# EasyEDA Pro project miniMagSwitch.eprj

# Schematic Schematic1
Board Name: Board1; Create Date: 2024-08-31
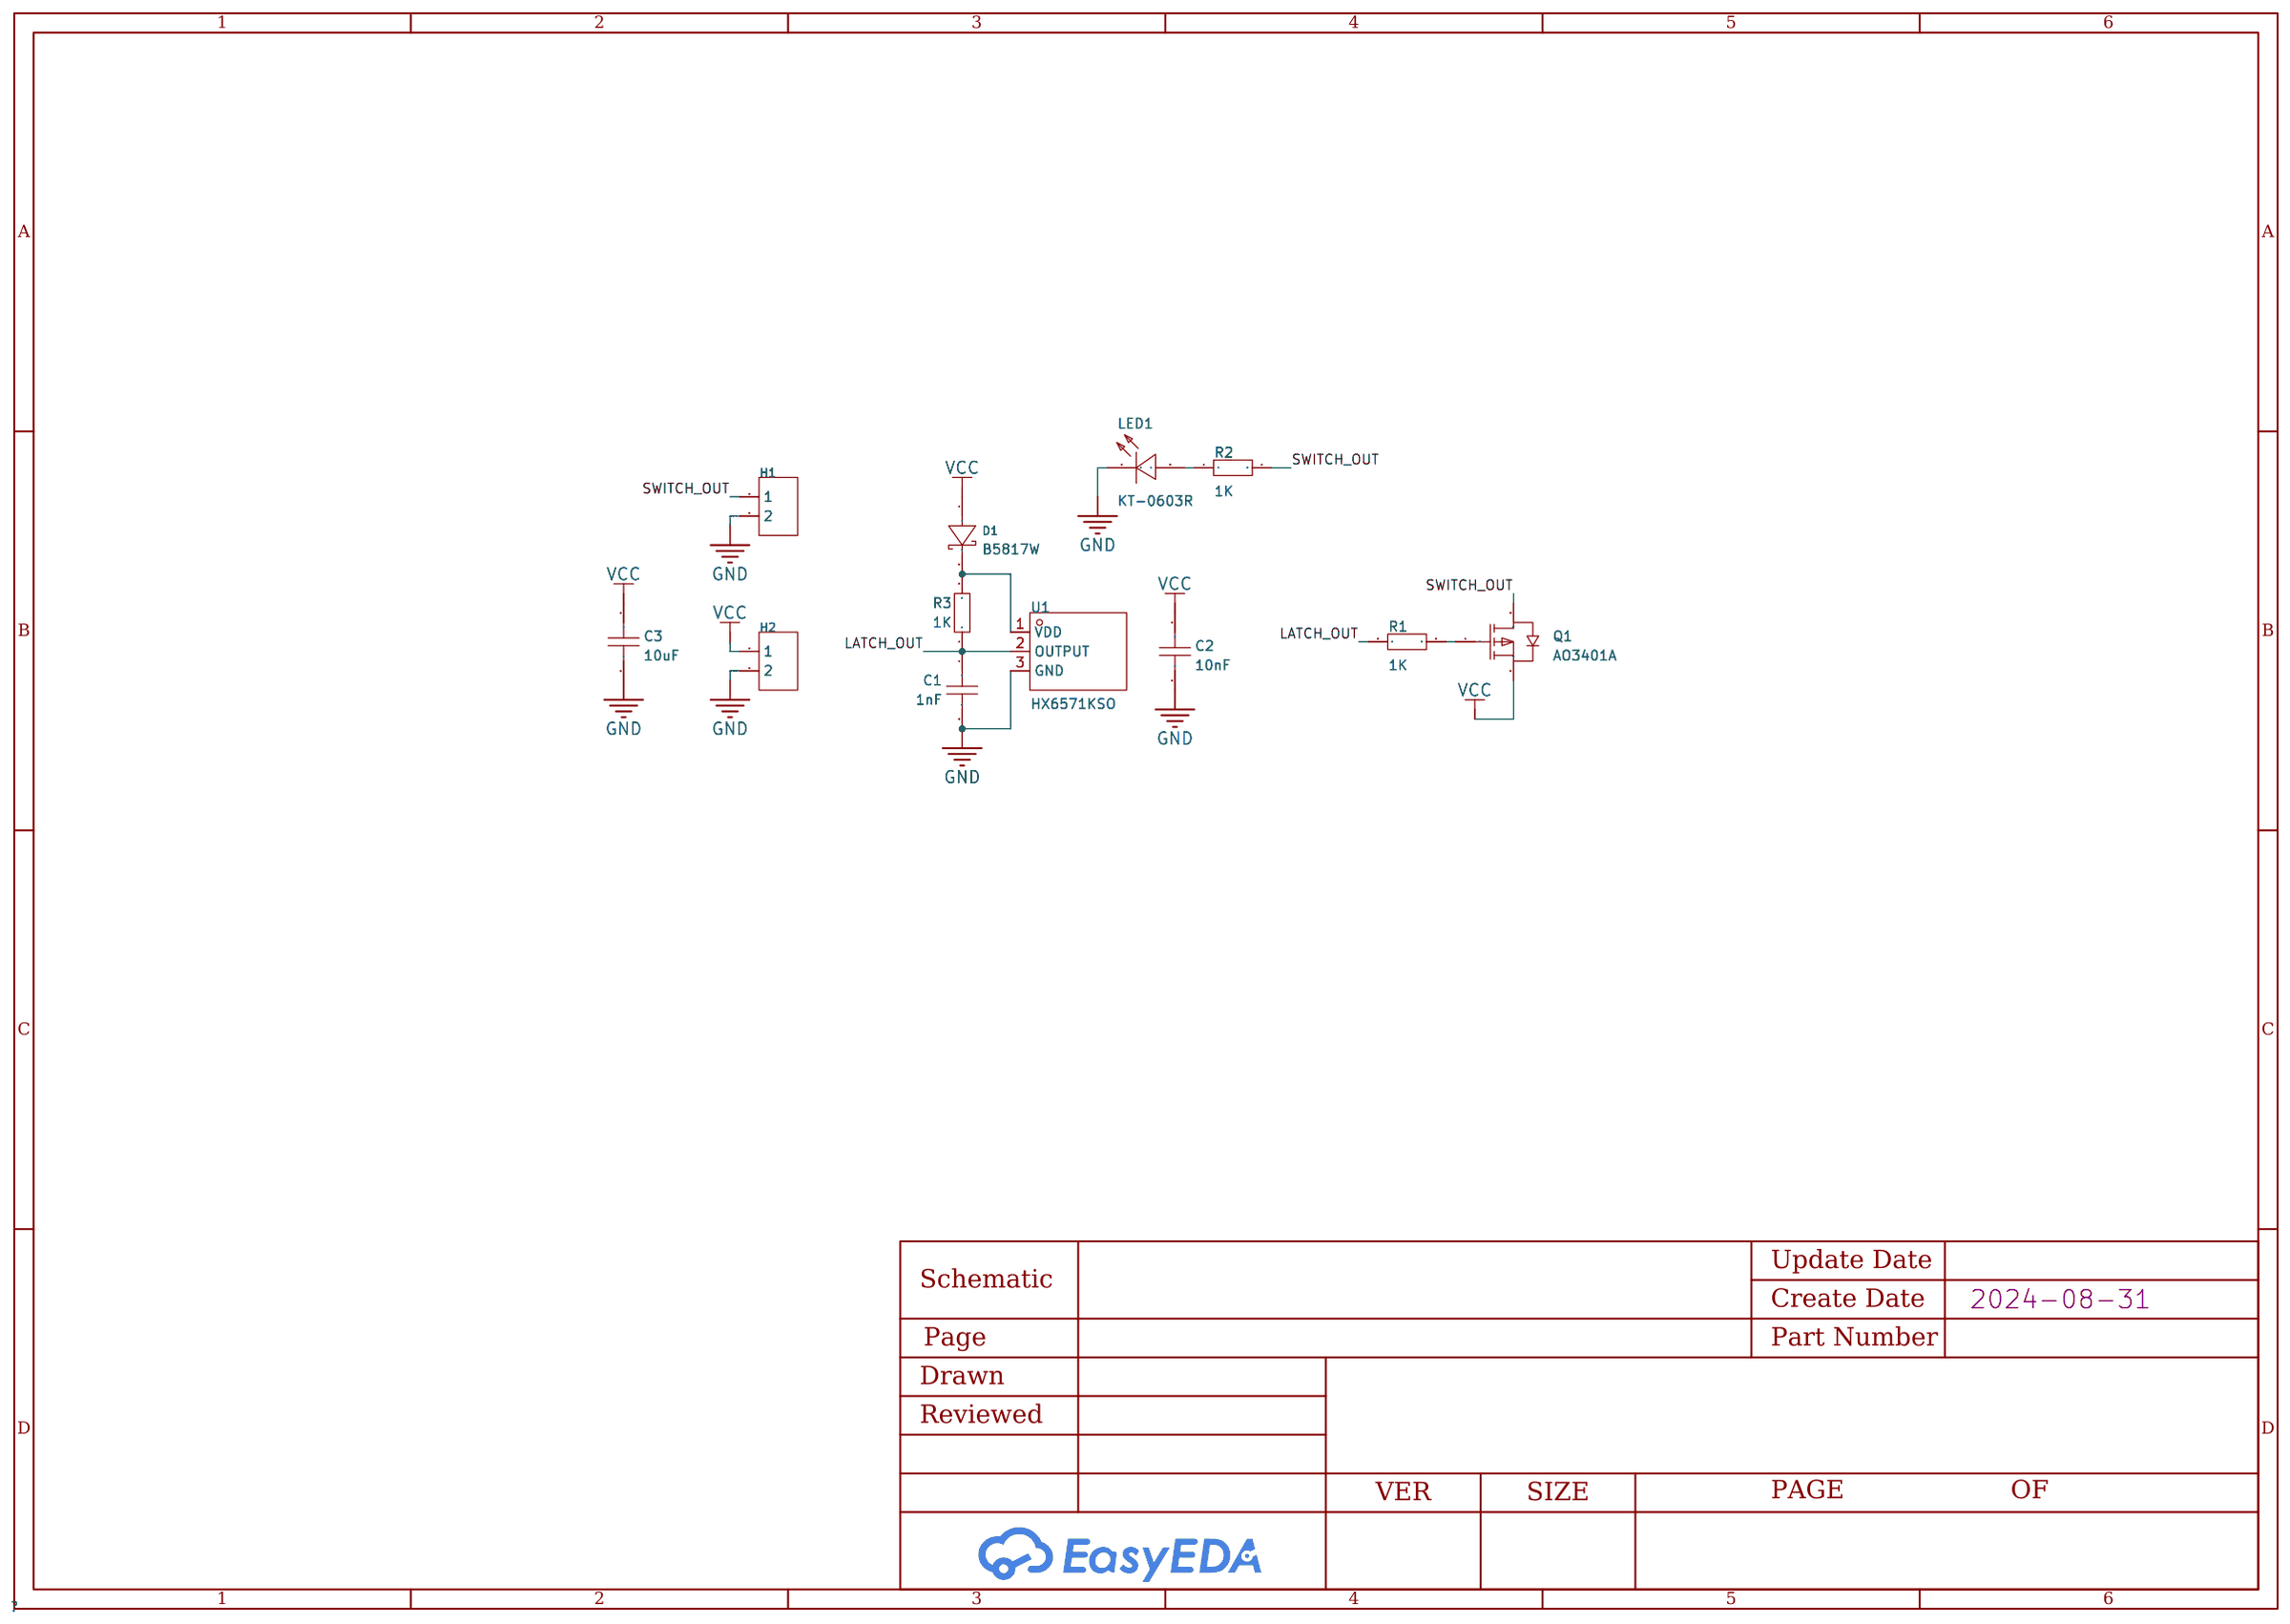
[diagram p0: schematic sheet]

## Parts
C1  1nF  [C0402]
C2  10nF  [C0402]
C3  10uF  [C0402]
D1  B5817W  [SOD-123_L2.7-W1.6-LS3.7-FD]
H1  -  [HDR-TH_2P-P2.54-V-F]
H2  -  [HDR-TH_2P-P2.54-V-F]
LED1  KT-0603R  [LED0603-RD]
Q1  AO3401A  [SOT-23_L2.9-W1.3-P1.90-LS2.4-BR]
R1  1K  [R0402]
R2  1K  [R0402]
R3  1K  [R0402]
U1  HX6571KSO  [SOT-23-3_L2.9-W1.5-P1.90-LS2.8-BR-1]

## Library data of the parts
C1-C3 = CAP_0603: Supplier Footprint: 0603
D1 = B5817W_C7420328: LCSC Part Name: 电压:20V 电流:1A; Supplier Part: C7420328; Manufacturer: 宏迦橙; Supplier Footprint: SOD-123; JLCPCB Part Class: Extended Part; Datasheet: https://atta.szlcsc.com/upload/public/pdf/source/20230828/EE0D571642CD3E42C48F1182066654A1.pdf; Supplier: LCSC; Diode Configuration: Single; Forward Voltage (Vf@If): 450mV@1.0A; Reverse Voltage (Vr): 20V; Average Rectified Current (Io): 1A; Reverse Leakage Current (Ir): 1mA@20V; Peak forward surge current: 9A
H1 H2 = HDR-F_2.54_1x2P: Supplier Footprint: Through
LED1 = KT-0603R: LCSC Part Name: 0603 红灯 高亮; Supplier Part: C2286; Manufacturer: KENTO; Supplier Footprint: 0603; JLCPCB Part Class: Basic Part; Datasheet: https://atta.szlcsc.com/upload/public/pdf/source/20160616/1466072038404.pdf; Supplier: LCSC; Emitted Color: Red; Operating Temperature: -40℃~+85℃
Q1 = AO3401A_C15127: LCSC Part Name: 1个P沟道 耐压:30V 电流:4A; Supplier Part: C15127; Manufacturer: AOS; Supplier Footprint: SOT-23; JLCPCB Part Class: Basic Part; Datasheet: https://atta.szlcsc.com/upload/public/pdf/source/20160507/1462613609053.pdf; Supplier: LCSC; Type: 1个PChannel; Drain Source On Resistance (RDS(on)@Vgs,Id): 44mΩ@10V,4.3A; Gate Threshold Voltage (Vgs(th)@Id): 1.3V@250uA; Total Gate Charge (Qg@Vgs): 12.2nC@4.5V; Input Capacitance (Ciss@Vds): 1.2nF@15V; Operating Temperature: -55℃~+150℃@(Tj)
R1-R3 = Res_0603: Supplier Footprint: 0603
U1 = HX6571KSO: LCSC Part Name: 高灵敏度双极锁存型霍尔元件霍尔开关; Supplier Part: C495738; Manufacturer: HUAXIN(华芯); Supplier Footprint: SOT-23; JLCPCB Part Class: Extended Part; Datasheet: https://atta.szlcsc.com/upload/public/pdf/source/20240416/C1D7618386CA82D00CE1A064A4E625BC.pdf; Supplier: LCSC

## Nets
GND: C1.2 C2.2 C3.2 H1.2 H2.2 LED1.1(K) U1.3(GND)
VCC: C2.1 C3.1 D1.1(A) H2.1 Q1.2(S)
LATCH_OUT: C1.1 R1.2 R3.1 U1.2(OUTPUT)
SWITCH_OUT: H1.1 Q1.3(D) R2.2
$1N288: D1.2(K) R3.2 U1.1(VDD)
$1N305: Q1.1(G) R1.1
$1N1430: LED1.2(A) R2.1

# Board PCB1
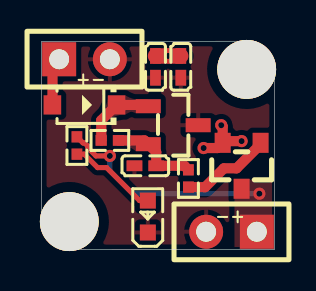
[diagram p1: board, top side]
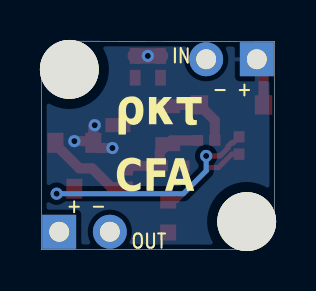
[diagram p2: board, bottom side, seen from below]

Outline 11.68 x 10.44 mm; copper layers: Top Layer, Bottom Layer. Coordinates in mm from the lower left corner of the outline.
Outline path: 0,10.42 0,1.41 1.4,1.41 1.4,0 11.68,0.01 11.68,9.03 10.26,9.03 10.26,10.44 0,10.42
Stack: Top Layer 0.035mm / Dielectric1 1.51mm FR4 er 4.5 / Bottom Layer 0.035mm

## Design rules (mm)
template: Custom Config
spacing copperThickness1oz (default): track to track 0.102, other pairs 0.152 to 0.3
spacing copperThickness2oz: track to track 0.203, other pairs 0.152 to 0.3
track width copperThickness1oz (default): min 0.127, default 0.254, max 2.54
track width copperThickness2oz: min 0.203, default 0.254, max 2.54
differential pair differentialPair (default): width min 0.127, default 0.254, max 2.54; gap min 0.152, default 0.152
via viaSize (default): diameter min 0.5, default 0.61, max 10; hole min 0.3, default 0.305, max 6.299

## Placement (name value [footprint] x y rotation side)
C1  1nF  [C0402]  5.21 4.2 180 top
C2  10nF  [C0402]  6.99 9.15 270 top
C3  10uF  [C0402]  5.72 9.15 270 top
D1  B5817W  [SOD-123_L2.7-W1.6-LS3.7-FD]  2.16 7.25 0 top
H1  -  [HDR-TH_2P-P2.54-V-F]  9.53 0.9 180 top
H2  -  [HDR-TH_2P-P2.54-V-F]  2.16 9.54 0 top
LED1  KT-0603R  [LED0603-RD]  5.33 1.66 90 top
NOREF  -  [Pad_e35]  1.4 1.41 0 top
NOREF#2  -  [Pad_e18]  10.29 9.03 0 top
Q1  AO3401A  [SOT-23_L2.9-W1.3-P1.90-LS2.4-BR]  10.03 4.2 90 top
R1  1K  [R0402]  7.37 3.57 90 top
R2  1K  [R0402]  1.78 5.22 90 top
R3  1K  [R0402]  3.43 5.47 180 top
U1  HX6571KSO  [SOT-23-3_L2.9-W1.5-P1.90-LS2.8-BR-1]  6.6 6.23 180 top

## Footprints (pads in the part's own frame, mm; a bottom-side part is the same pattern mirrored in y, then rotated)
C0402
  rect 0.79x0.54 smd: 1(-0.545,0) 2(0.545,0)
HDR-TH_2P-P2.54-V-F
  rect 1.7x1.7 hole 1: 1(-1.27,0)
  round 1.7 hole 1: 2(1.27,0)
LED0603-RD
  rect 0.8x0.8 smd: 1(-0.799,0) 2(0.799,0)
Pad_e18
  round 2.946 hole 2.946: 1(0,0)
Pad_e35
  round 2.946 hole 2.946: 1(0,0)
R0402
  rect 0.566x0.54 smd: 1(-0.433,0) 2(0.433,0)
SOD-123_L2.7-W1.6-LS3.7-FD
  rect 0.88x0.96 smd: 1(-1.61,0) 2(1.61,0)
SOT-23-3_L2.9-W1.5-P1.90-LS2.8-BR-1
  rect 1.25x0.7 smd: 1(1.25,-0.95) 2(1.25,0.95) 3(-1.25,0)
SOT-23_L2.9-W1.3-P1.90-LS2.4-BR
  rect 1x0.8 smd: 1(1.15,-0.95) 2(1.15,0.95) 3(-1.15,0)

## Nets
As in the schematic.

Pads without a net: NOREF 1; NOREF#2 1

## Via types
v1: diameter 0.61, hole 0.305, Top Layer to Bottom Layer, 6 vias

## Routing (per net, layer and track width the routed paths; a pad name or vN(x,y) marks a point on that pad's centre or on a via; arc(x,y) is an arc through that point)
VCC: length 6.7
  Top Layer w0.508: Q1.2 9.17,5.44 v1(10.03,5.44) ; Q1.2 9.08,6.16 v1(9.01,6.23) ; Q1.2 8.82,5.09 v1(8.13,5.09) ; 0.55,7.25 0.55,9.2 H2.1
  Top Layer w0.762: C2.1 v1(6.35,9.7) C3.1
LATCH_OUT: length 4.5
  Top Layer w0.508: R1.2 7.16,4.2 C1.1 5.75,4.89 U1.2 5.17,5.47 R3.1
SWITCH_OUT: length 10.8
  Top Layer w0.254: v1(3.43,4.69) 2.73,4.69 2.33,5.1 2.33,5.18 2.16,5.35 2.08,5.35 R2.2
  Bottom Layer w0.254: v1(3.43,4.69) 3.43,3.95 4.57,2.8 v1(10.92,2.8)
$1N288: length 3.7
  Top Layer w0.508: R3.2 3,6.48 D1.2 5.29,7.25 U1.1
$1N305: length 4.6
  Top Layer w0.508: 10.98,5.35 10.98,5.28 9.78,4.07 9.14,4.07 8.2,3.13 R1.1
$1N1430: length 4.5
  Top Layer w0.254: LED1.2 4.92,2.46 3.27,4.11 2.81,4.11 2.14,4.78 R2.1

## Copper pours and planes (outline as drawn; the poured copper is in the pictures)
GND on Top Layer: 0,10.42 11.94,10.55 11.68,0.01 0,0.01
VCC on Bottom Layer: 0,10.42 11.68,10.42 11.68,0.01 0,0.01
SWITCH_OUT on Top Layer: 9.67,3.5 11.56,3.5 11.56,0.14 9.67,0.14

Small or netless copper shapes (teardrops, artwork), in the pictures only: 6 on Top Layer

## Text on the board
Bottom Silkscreen Layer: - + | IN | OUT | CFA | ρκτ
Top Silkscreen Layer: +- | -+
